# Altium schematic sheet node24-channel.SchDoc: Output Channel
size Tabloid; Author: Emergence Team; Engineer: asheem; Organization: Emergence; Address1: Oakland, California; Address2: a@aliengeometry.com; Address3: Black Rock City '18; Address4: OPEN SOURCE H/W; DocumentNumber: 4; Revision: Rev 0.1; SheetNumber: 4; SheetTotal: 6; Project: NODE24
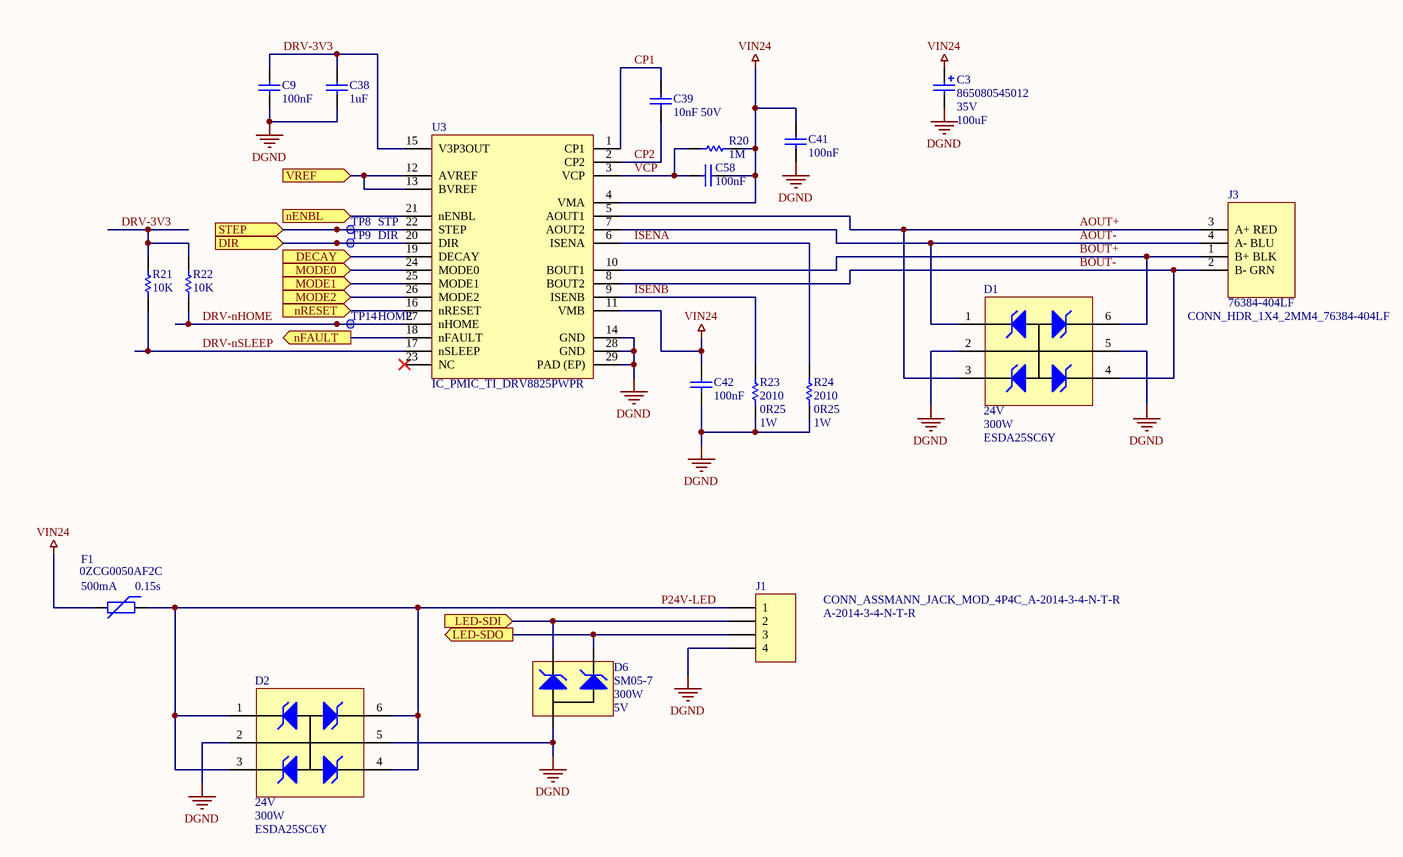
[diagram p0: node24-channel.SchDoc]

## Parts
C3  Manufacturer Part Number: 865080545012  Voltage Rating (DC): 35V  Capacitance: 100uF  [CAPAE_D6MM3]  (hidden comment: CAP_ALUM_100UF_35V_6MM3_SMT_865080545012)
C9  100nF  [CAPC0603(1608)100_L]
C38  1uF  [CAPC0603(1608)100_L]
C39  10nF 50V  [CAPC0603(1608)100_L]
C41  100nF  [CAPC0603(1608)100_L]
C42  100nF  [CAPC0603(1608)100_L]
C58  100nF  [CAPC0603(1608)100_L]
D1  Operating Supply Voltage: 24V  Peak Pulse Power: 300W  Manufacturer Part Number: ESDA25SC6Y  [SOT23-6L]  (hidden comment: TVS_24V_QUAD_300W_SOT23-6_ESDA25SC6Y)
D2  Operating Supply Voltage: 24V  Peak Pulse Power: 300W  Manufacturer Part Number: ESDA25SC6Y  [SOT23-6L]  (hidden comment: TVS_24V_QUAD_300W_SOT23-6_ESDA25SC6Y)
D6  Manufacturer Part Number: SM05-7  Max Power Dissipation: 300W  Reverse Standoff Voltage: 5V  [SOT-23]  (hidden comment: TVS_5V_DUAL_SOT23-3_SM05-7)
F1  Hold Current: 500mA  Time to Trip: 0.15s  Manufacturer Part Number: 0ZCG0050AF2C  [FUSE_1812]  (hidden comment: FUSE_BELFUSE_PTC_30V_500MA_1812_0ZCG0050AF2C)
J1  CONN_ASSMANN_JACK_MOD_4P4C_A-2014-3-4-N-T-R  Manufacturer Part Number: A-2014-3-4-N-T-R  [CON_JACK_MOD_4P4C_ASSMANN_A-2014-3-4-N-T-R]
J3  CONN_HDR_1X4_2MM4_76384-404LF  Manufacturer Part Number: 76384-404LF  [HDR_1x4_2R54_V_M]
R20  1M  [RESC0603(1608)_L]
R21  10K  [RESC0603(1608)_L]
R22  10K  [RESC0603(1608)_L]
R23  Case Code (Imperial): 2010  Resistance: 0R25  Power Rating: 1W  [RES2010N]  (hidden comment: RES_2010_0R25_1W_CSRN2010FKR250)
R24  Case Code (Imperial): 2010  Resistance: 0R25  Power Rating: 1W  [RES2010N]  (hidden comment: RES_2010_0R25_1W_CSRN2010FKR250)
TP8  STP  [TP_1MM]
TP9  DIR  [TP_1MM]
TP14  HOME  [TP_1MM]
U3  IC_PMIC_TI_DRV8825PWPR  [IC_TSSOP28_0MM65_EP52X31]

## Ports
DECAY (in), DIR (in), LED-SDI (in), LED-SDO (out), MODE0 (in), MODE1 (in), MODE2 (in), nENBL (in), nFAULT (out), nRESET (in), STEP (in), VREF (in)

## Nets
DGND: C3.2 C9.1 C38.1 C41.2 C42.2 D1.2(A1) D1.5(A2) D2.2(A1) D2.5(A2) D6.3(A) J1.4 R23.2 R24.2 U3.14(GND) U3.28(GND) U3.29(PAD_(EP))
VIN24: C3.1 C41.1 C42.1 C58.1 F1.2 R20.2 U3.4(VMA) U3.11(VMB)
AOUT+: D1.3(K2) J3.3(A+_RED) U3.5(AOUT1)
AOUT-: D1.1(K1) J3.4(A-_BLU) U3.7(AOUT2)
BOUT+: D1.6(K4) J3.1(B+_BLK) U3.10(BOUT1)
BOUT-: D1.4(K3) J3.2(B-_GRN) U3.8(BOUT2)
CP1: C39.2 U3.1(CP1)
CP2: C39.1 U3.2(CP2)
DECAY: U3.19(DECAY) ; port DECAY
DIR: TP9.1 U3.20(DIR) ; port DIR
DRV-3V3: C9.2 C38.2 R21.2 R22.2 U3.15(V3P3OUT)
DRV-nHOME: R22.1 TP14.1 U3.27(nHOME)
DRV-nSLEEP: R21.1 U3.17(nSLEEP)
ISENA: R24.1 U3.6(ISENA)
ISENB: R23.1 U3.9(ISENB)
LED-SDI: D6.1(K1) J1.2 ; port LED-SDI
LED-SDO: D6.2(K2) J1.3 ; port LED-SDO
MODE0: U3.24(MODE0) ; port MODE0
MODE1: U3.25(MODE1) ; port MODE1
MODE2: U3.26(MODE2) ; port MODE2
nENBL: U3.21(nENBL) ; port nENBL
nFAULT: U3.18(nFAULT) ; port nFAULT
nRESET: U3.16(nRESET) ; port nRESET
P24V-LED: D2.1(K1) D2.3(K2) D2.4(K3) D2.6(K4) F1.1 J1.1
STEP: TP8.1 U3.22(STEP) ; port STEP
VCP: C58.2 R20.1 U3.3(VCP)
VREF: U3.12(AVREF) U3.13(BVREF) ; port VREF

Not connected (* = marked no-connect by the designer): U3 23(NC)*

## Notes on the sheet
- Title
- Size
- Date:
- Tabloid
- Number
- Engineer:
- Revision
- Sheet
- of
- File:
- SVN:

## Library data of the parts
C3 = CAP_ALUM_100UF_35V_6MM3_SMT_865080545012: WURTH ELEKTRONIK         865080545012             SMD Aluminium Electrolytic Capacitor, Radial Can - SMD, 100 F, 35 V, WCAP-ASLI Series; Manufacturer: Wurth Electronics; Life (Hours): 2000Hour; Ripple Current (AC): 300mA; Supplier 1: Digi-Key; Stock 1: 5637; Pricing 1: 1=0.33, 50=0.278, 100=0.242, 250=0.215 (USD); Case/Package: Radial; Min Operating Temperature: -55°C; Max Operating Temperature: 105°C; Voltage Rating: 35V; Packaging: Cut Tape; Diameter: 6.3mm; Height: 7.7mm; REACH SVHC: Unknown; ComponentLink1URL: http://www.farnell.com/datasheets/1880164.pdf; ComponentLink1Description: http://www.farnell.com/datasheets/1880164.pdf; ComponentLink2URL: http://katalog.we-online.de/pbs/datasheet/865080545012.pdf; ComponentLink2Description: http://katalog.we-online.de/pbs/datasheet/865080545012.pdf; Supplier Part Number 1: 732-8511-6-ND
C9 C41 C42 C58 = CMP-1035-02593-1: CAP 100nF 50V ±20% 0603 (1608 Metric) Thickness 1mm SMD; Tolerance: Â±20%; Case-EIA: 0603; Case-Metric: 1608; Max Thickness: 1 mm; Value: 100nF; Technology: SMT; Rated Voltage: 50 V
C38 = CMP-1035-02734-1: CAP 1uF 10V ±20% 0603 (1608 Metric) Thickness 1mm SMD; Tolerance: Â±20%; Case-EIA: 0603; Case-Metric: 1608; Technology: SMT; Value: 1uF; Max Thickness: 1 mm; Rated Voltage: 10 V
C39 = CMP-1035-02322-1: CAP 10nF 50V ±20% 0603 (1608 Metric) Thickness 1mm SMD; Case-Metric: 1608; Tolerance: Â±20%; Case-EIA: 0603; Rated Voltage: 50 V; Value: 10nF; Max Thickness: 1 mm; Technology: SMT
D1 D2 = TVS_24V_QUAD_300W_SOT23-6_ESDA25SC6Y: TVS DIODE 24VWM 30VC SOT23; Manufacturer: STMicroelectronics; Direction: Unidirectional; Capacitance: 60pF; Max Surge Current: 7A; Clamping Voltage: 30V; Number of Unidirectional Channels: 4; Min Breakdown Voltage: 25V; Power Line Protection: No; Leakage Current: 1uA; Peak Pulse Current: 10A; Supplier 1: Digi-Key; Stock 1: 18642; Pricing 1: 1=0.52, 10=0.419, 100=0.2855, 500=0.21414, 1000=0.16061 (USD); Mount: Surface Mount; Case/Package: SOT-23-6; Number of Pins: 6; Min Operating Temperature: -40°C; Max Operating Temperature: 150°C; Working Voltage: 24V; Packaging: Tape and Reel; Package Quantity: 1; Polarity: Unidirectional; Termination: SMD/SMT; Reverse Standoff Voltage: 24V; Length: 3mm; Height: 3mm; Depth: 1.75mm; Radiation Hardening: No; Lead Free: Lead Free; ComponentLink1URL: https://datasheet.ciiva.com/12326/dm00035423-211710-12326640.pdf; ComponentLink1Description: https://datasheet.ciiva.com/12326/dm00035423-211710-12326640.pdf; ComponentLink2URL: https://datasheet.ciiva.com/6577/dm00035423-6577883.pdf; ComponentLink2Description: https://datasheet.ciiva.com/6577/dm00035423-6577883.pdf; ComponentLink3URL: https://datasheet.ciiva.com/6577/dm00035423-6577884.pdf; ComponentLink3Description: https://datasheet.ciiva.com/6577/dm00035423-6577884.pdf; ComponentLink4URL: https://datasheet.ciiva.com/6577/dm00035423-6577885.pdf; ComponentLink4Description: https://datasheet.ciiva.com/6577/dm00035423-6577885.pdf; ComponentLink5URL: https://datasheet.ciiva.com/25958/dm00035423-25958158.pdf; ComponentLink5Description: https://datasheet.ciiva.com/25958/dm00035423-25958158.pdf; ComponentLink6URL: https://datasheet.ciiva.com/41443/001184002-da-01-en-tvs-diode-24v-300w-esda25sc6y-sot-23-stm-41443447.pdf; ComponentLink6Description: https://datasheet.ciiva.com/41443/001184002-da-01-en-tvs-diode-24v-300w-esda25sc6y-sot-23-stm-41443447.pdf; Supplier Part Number 1: 497-13421-6-ND; Breakdown Voltage: 25V
D6 = TVS_5V_DUAL_SOT23-3_SM05-7: TVS DIODE 5VWM 20.6VC SOT23; Manufacturer: Diodes; Direction: Unidirectional,Bidirectional; Element Configuration: Common Anode; Capacitance: 230pF; Number of Unidirectional Channels: 2; Clamping Voltage: 20.6V; Power Line Protection: No; Polarity: Unidirectional; Breakdown Voltage: 7.3V; Leakage Current: 10uA; ESD Protection: Yes; Test Current: 1mA; Peak Pulse Current: 17A; Min Breakdown Voltage: 6.2V; Supplier 1: Digi-Key; Stock 1: 20844; Pricing 1: 1=0.46, 10=0.341, 100=0.1932, 500=0.12792, 1000=0.09808 (USD); Mount: Surface Mount; Case/Package: SOT-23; Number of Pins: 3; Contact Plating: Tin,Matte; Min Operating Temperature: -55°C; Max Operating Temperature: 150°C; Package Quantity: 3000; Packaging: Tape and Reel; Peak Pulse Power: 300W; Termination: SMD/SMT; Working Voltage: 5V; Max Reverse Leakage Current: 10uA; Length: 2.9mm; Height: 1mm; Width: 1.3mm; Depth: 1.3mm; Radiation Hardening: No; Lead Free: Lead Free; ComponentLink1URL: https://datasheet.ciiva.com/333/ds31828-333314.pdf; ComponentLink1Description: https://datasheet.ciiva.com/333/ds31828-333314.pdf; ComponentLink2URL: https://datasheet.ciiva.com/15186/getdatasheetpartid-375729-15186470.pdf; ComponentLink2Description: https://datasheet.ciiva.com/15186/getdatasheetpartid-375729-15186470.pdf; ComponentLink3URL: https://datasheet.ciiva.com/25956/ds31828-25956699.pdf; ComponentLink3Description: https://datasheet.ciiva.com/25956/ds31828-25956699.pdf; ComponentLink4URL: https://datasheet.ciiva.com/13083/ds31828-89171-13083151.pdf; ComponentLink4Description: https://datasheet.ciiva.com/13083/ds31828-89171-13083151.pdf; Supplier Part Number 1: SM05-7DIDKR-ND
F1 = FUSE_BELFUSE_PTC_30V_500MA_1812_0ZCG0050AF2C: PTC RESETTABLE 30V 500MA 1812; Manufacturer: Bel; Max Current Rating: 100A; Trip Current: 1A; Supplier 1: Digi-Key; Stock 1: 278574; Pricing 1: 1=0.14, 5=0.134, 10=0.129, 50=0.1148, 100=0.1069, 250=0.09504, 500=0.0792, 1000=0.07524 (USD); Mount: Surface Mount; Case/Package: 1812; Case Code (Metric): 4532; Case Code (Imperial): 1812; Contact Plating: Tin,Matte; Min Operating Temperature: -40°C; Max Operating Temperature: 85°C; Package Quantity: 1; Packaging: Tape and Reel; Lead Free: Lead Free; ComponentLink1URL: https://datasheet.ciiva.com/18550/0zcg-18550748.pdf; ComponentLink1Description: https://datasheet.ciiva.com/18550/0zcg-18550748.pdf; ComponentLink2URL: https://datasheet.ciiva.com/18550/0zcg-18550749.pdf; ComponentLink2Description: https://datasheet.ciiva.com/18550/0zcg-18550749.pdf; ComponentLink3URL: https://datasheet.ciiva.com/18550/0zcg-18550750.pdf; ComponentLink3Description: https://datasheet.ciiva.com/18550/0zcg-18550750.pdf; Supplier Part Number 1: 507-1762-6-ND
J1 = CONN_ASSMANN_JACK_MOD_4P4C_A-2014-3-4-N-T-R: CONN MOD JACK 4P4C VERT; Shielding: Unshielded; Max Current Rating: 1.5A; Contact Resistance: 20mR; Number of Ports: 1; Number of Positions Loaded: 4; Max Voltage Rating (AC): 120V; Direction: User Selectable; Pitch: 2.54mm; Supplier 1: Digi-Key; Manufacturer: Assmann; Stock 1: 29088; Pricing 1: 1=0.55, 10=0.516, 25=0.4644, 50=0.4128, 100=0.3956, 250=0.3612, 500=0.344, 1000=0.2838, 2500=0.258 (USD); Mount: Through Hole; Contact Material: Bronze; Contact Plating: Nickel,Gold; Housing Colour: Black; Housing Material: Glass; Min Operating Temperature: -40°C; Max Operating Temperature: 85°C; Package Quantity: 130; Number of Rows: 1; Packaging: Tray; Termination: Solder; Orientation: Vertical; Connector Type: Jack; Length: 11.43mm; Depth: 16.5mm; Lead Free: Lead Free; ComponentLink1URL: http://components.arrow.com/part/dataview/0323_07027207; ComponentLink1Description: http://components.arrow.com/part/dataview/0323_07027207; ComponentLink2URL: http://www.assmann-wsw.com/fileadmin/datasheets/ASS_7331_CO.PDF; ComponentLink2Description: http://www.assmann-wsw.com/fileadmin/datasheets/ASS_7331_CO.PDF; ComponentLink3URL: http://www.assmann.us/specs/A-2014-3-4-N-T-R.pdf; ComponentLink3Description: http://www.assmann.us/specs/A-2014-3-4-N-T-R.pdf; Supplier Part Number 1: AE10393-ND
J3 = CONN_HDR_1X4_2MM4_76384-404LF: Manufacturer: Amphenol FCI; Number of Contacts: 4; Current Rating: 3A; Voltage Rating: 1kV; Connector Type: Male Pin; Gender: Male; Pitch: 2.54mm; Mating Post Length: 5mm; Supplier 1: Digi-Key; Stock 1: 1255; Pricing 1: 1=0.65, 10=0.611, 100=0.4687, 500=0.4076, 1000=0.33627, 5000=0.29551, 10000=0.27513 (USD); Mount: Through Hole; Contact Plating: Nickel,Tin,Gold; Colour: Black; Contact Material: Bronze,Copper Alloy; Housing Colour: Black; Housing Material: Thermoplastic; Min Operating Temperature: -40°C; Max Operating Temperature: 125°C; Number of Rows: 1; Termination: Solder; Package Quantity: 500; Packaging: Bulk; Number of Positions: 4; Max Voltage Rating (AC): 1kV; Orientation: Straight; Fastening Type: Friction; Length: 9.16mm; Contact Mating Length: 0.197inch; Termination Post Length: 3.4mm; Width: 4.7mm; Depth: 5mm; Radiation Hardening: No; Lead Free: Lead Free; ComponentLink1URL: https://datasheet.ciiva.com/713/76384-713329.pdf; ComponentLink1Description: https://datasheet.ciiva.com/713/76384-713329.pdf; ComponentLink2URL: https://datasheet.ciiva.com/16689/76384-16689063.pdf; ComponentLink2Description: https://datasheet.ciiva.com/16689/76384-16689063.pdf; ComponentLink3URL: https://datasheet.ciiva.com/9473/76384-9473260.pdf; ComponentLink3Description: https://datasheet.ciiva.com/9473/76384-9473260.pdf; Supplier Part Number 1: 609-1319-ND
R20 = CMP-1012-00849-1: 1M 0.1W 1% 0603 (1608 Metric)  SMD; Value: 1000000.00 Ohm; Case-EIA: 0603; Case-Metric: 1608; Power: 0.1 W; Tolerance: 1 %; Technology: SMT
R21 R22 = CMP-1012-00623-1: 10K 0.1W 1% 0603 (1608 Metric)  SMD; Value: 10000.00 Ohm; Case-EIA: 0603; Case-Metric: 1608; Power: 0.1 W; Tolerance: 1 %; Technology: SMT
R23 R24 = RES_2010_0R25_1W_CSRN2010FKR250: Res Thick Film 2010 0.25 Ohm 1% 1W ±250ppm/C Molded SMD Plastic T/R; Manufacturer: Stackpole Electronics; Temperature Coefficient: 250ppm/°C; Supplier 1: Digi-Key; Manufacturer Part Number: CSRN2010FKR250; Stock 1: 10883; Pricing 1: 1=0.65, 10=0.462, 25=0.3604, 50=0.305, 100=0.2402, 250=0.20328, 500=0.16632 (USD); Mount: Surface Mount; Case/Package: 2010; Case Code (Metric): 5025; Contact Plating: Tin,Matte; Min Operating Temperature: -55°C; Max Operating Temperature: 155°C; Packaging: Tape and Reel; Tolerance: 1%; Composition: Thick Film; Number of Terminations: 2; Military Standard: Not; Max Power Dissipation: 1W; Length: 0.197inch; Height: 0.03inch; Width: 0.097inch; Depth: 2.54mm; Radiation Hardening: No; Lead Free: Lead Free; ComponentLink1URL: https://datasheet.ciiva.com/26835/getdatasheetpartid-747701-26835495.pdf; ComponentLink1Description: https://datasheet.ciiva.com/26835/getdatasheetpartid-747701-26835495.pdf; Supplier Part Number 1: CSRN2010FKR250DKR-ND
TP8 TP9 TP14 = TEST_POINT: TEST_PAD_NO_PART; Manufacturer Part Number: None -- copper test pad
U3 = IC_PMIC_TI_DRV8825PWPR: IC MOTOR DRIVER PAR 28HTSSOP; Manufacturer: Texas Instruments; Output Current: 2.5A; Max Supply Voltage: 45V; Min Supply Voltage: 8V; Logic Function: AND; Supplier 1: Digi-Key; Stock 1: 66105; Pricing 1: 1=3.84, 10=3.452, 100=2.828, 500=2.4074, 1000=2.03034 (USD); Mount: Surface Mount; Case/Package: HTSSOP EP; Number of Pins: 28; Min Operating Temperature: -40°C; Max Operating Temperature: 85°C; Type: Integrated Circuit (IC); Packaging: Tape and Reel; Package Quantity: 1; Radiation Hardening: No; Lead Free: Lead Free; ComponentLink1URL: https://datasheet.ciiva.com/26086/drv8825-26086085.pdf; ComponentLink1Description: https://datasheet.ciiva.com/26086/drv8825-26086085.pdf; ComponentLink2URL: https://datasheet.ciiva.com/3229/drv8825-3229031.pdf; ComponentLink2Description: https://datasheet.ciiva.com/3229/drv8825-3229031.pdf; ComponentLink3URL: https://datasheet.ciiva.com/26810/getdatasheetpartid-625248-26810663.pdf; ComponentLink3Description: https://datasheet.ciiva.com/26810/getdatasheetpartid-625248-26810663.pdf; ComponentLink4URL: https://datasheet.ciiva.com/1959/drv8825-1959819.pdf; ComponentLink4Description: https://datasheet.ciiva.com/1959/drv8825-1959819.pdf; ComponentLink5URL: https://datasheet.ciiva.com/1959/drv8825-1959820.pdf; ComponentLink5Description: https://datasheet.ciiva.com/1959/drv8825-1959820.pdf; ComponentLink6URL: https://datasheet.ciiva.com/1959/drv8825-1959821.pdf; ComponentLink6Description: https://datasheet.ciiva.com/1959/drv8825-1959821.pdf; Supplier Part Number 1: 296-29503-6-ND; Nominal Supply Current: 2.5A; Manufacturer Part Number: DRV8825PWPR